# Altium project upper_board.PrjPcb
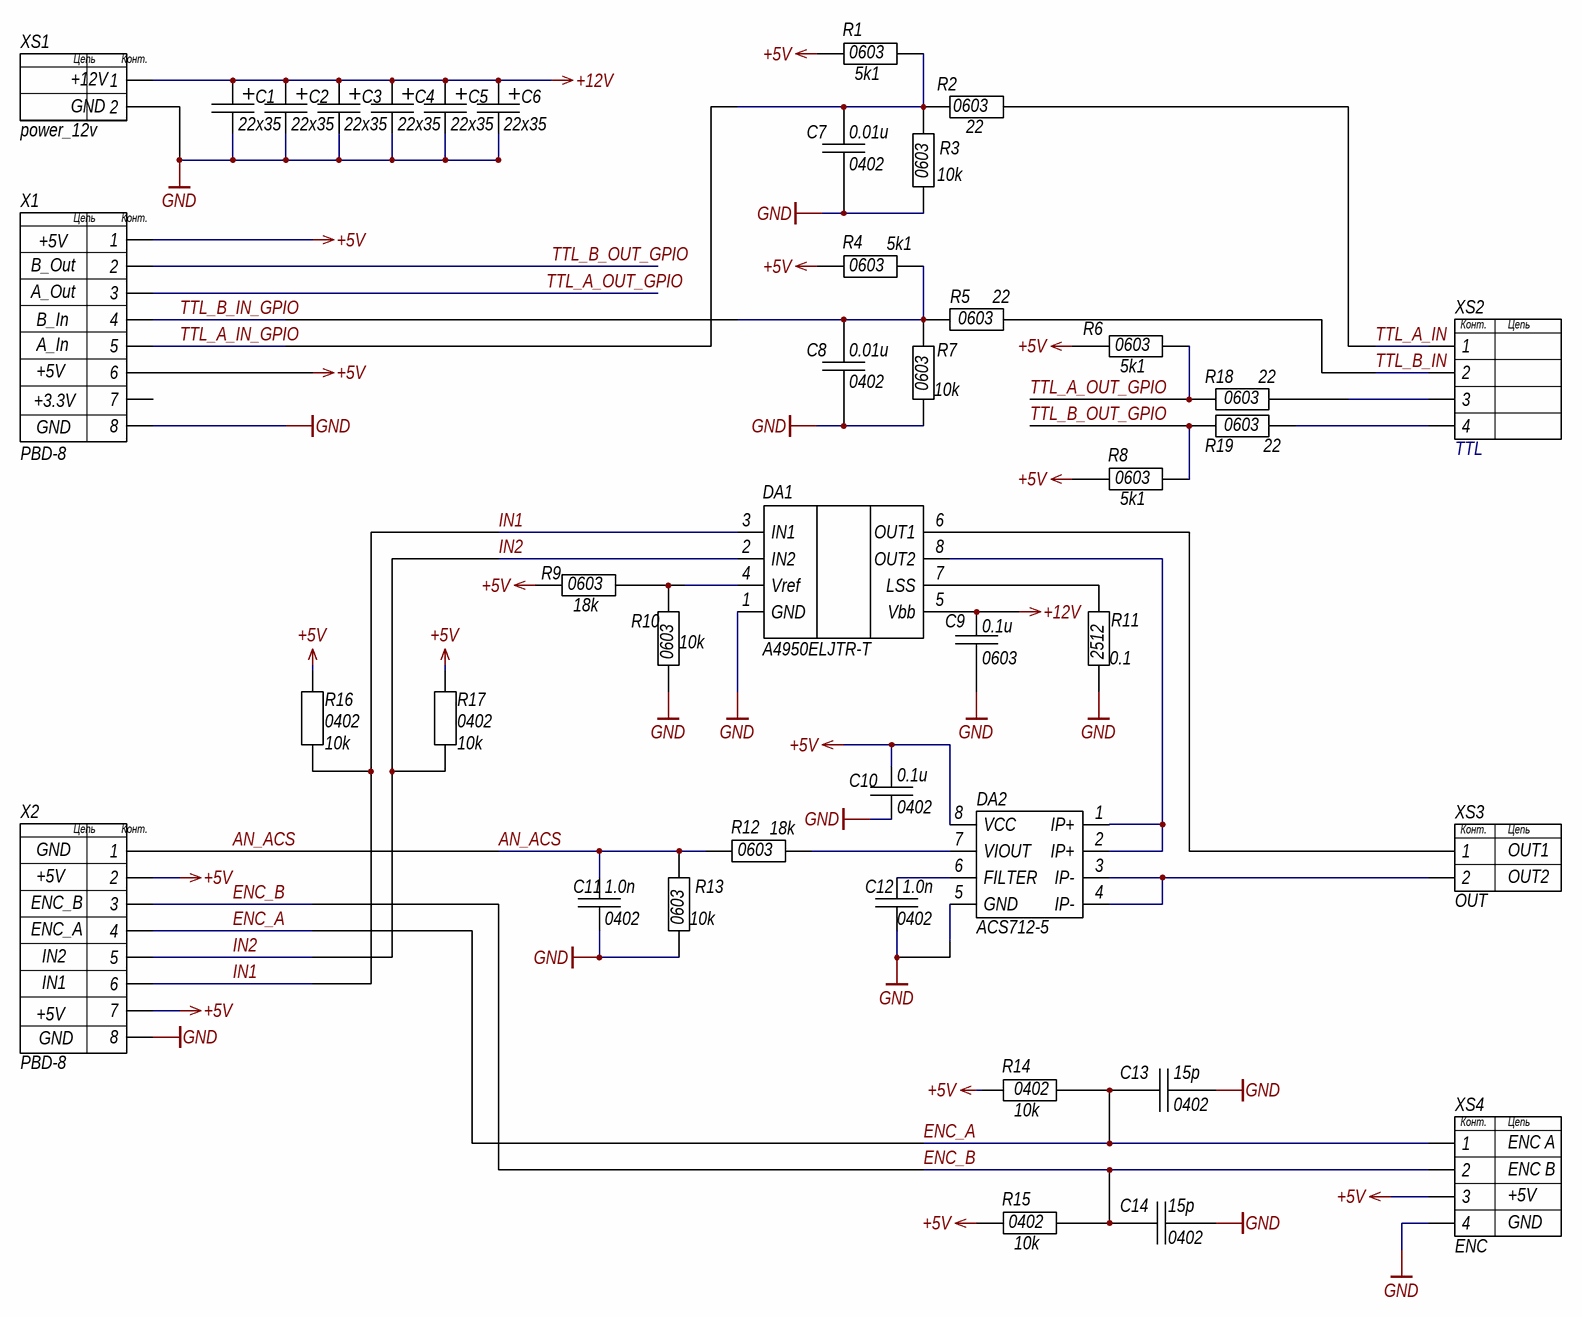
[diagram p0: powerful.SchDoc]
1 sheet, 41 parts. Net scope: global (net labels, ports and power ports of the same name join across sheets).
Board file: upper_PCB.PcbDoc

## Sheet powerful.SchDoc
size 420 x 297 mm; SheetNumber: 1; SheetTotal: 1

### Parts
C1  22x35  [CASE D]
C2  22x35  [CASE D]
C3  22x35  [CASE D]
C4  22x35  [CASE D]
C5  22x35  [CASE D]
C6  22x35  [CASE D]
C7  Case: 0402  [0402_CAP]  (hidden comment: 0.01u)
C8  Case: 0402  [0402_CAP]  (hidden comment: 0.01u)
C9  Case: 0603  [0603_CAP]  (hidden comment: 0.1u)
C10  Case: 0402  [0402_CAP]  (hidden comment: 0.1u)
C11  Case: 0402  [0402_CAP]  (hidden comment: 1.0n)
C12  Case: 0402  [0402_CAP]  (hidden comment: 1.0n)
C13  Case: 0402  [0402_CAP]  (hidden comment: 15p)
C14  Case: 0402  [0402_CAP]  (hidden comment: 15p)
DA1  A4950ELJTR-T  [SOIC-8-ER]
DA2  ACS712-5  [SOIC-8]
R1  Case: 0603  [0603_RES]  (hidden comment: 5k1)
R2  Power: 0603  [0603_RES]  (hidden comment: 22)
R3  Case: 0603  [0603_RES]  (hidden comment: 10k)
R4  Case: 0603  [0603_RES]  (hidden comment: 5k1)
R5  Power: 0603  [0603_RES]  (hidden comment: 22)
R6  Case: 0603  [0603_RES]  (hidden comment: 5k1)
R7  Case: 0603  [0603_RES]  (hidden comment: 10k)
R8  Case: 0603  [0603_RES]  (hidden comment: 5k1)
R9  Case: 0603  [0603_RES]  (hidden comment: 18k)
R10  Case: 0603  [0603_RES]  (hidden comment: 10k)
R11  Case: 2512  [2512_res]  (hidden comment: 0.1)
R12  Case: 0603  [0603_RES]  (hidden comment: 18k)
R13  Case: 0603  [0603_RES]  (hidden comment: 10k)
R14  Case: 0402  [0402_res]  (hidden comment: 10k)
R15  Case: 0402  [0402_res]  (hidden comment: 10k)
R16  Case: 0402  [0402_res]  (hidden comment: 10k)
R17  Case: 0402  [0402_res]  (hidden comment: 10k)
R18  Power: 0603  [0603_RES]  (hidden comment: 22)
R19  Power: 0603  [0603_RES]  (hidden comment: 22)
X1  PBD-8  Parameter 8: GND  Parameter 7: +3.3V  Parameter 6: +5V  Parameter 5: A_In  Parameter 4: B_In  Parameter 3: A_Out  Parameter 2: B_Out  [Header_8pin_2mm]
X2  PBD-8  Parameter 8: GND  Parameter 7: +5V  Parameter 6: IN1  Parameter 5: IN2  Parameter 4: ENC_A  Parameter 3: ENC_B  [Header_8pin_2mm]
XS1  power_12v  [STEP_2.54mm 2X1]
XS2  TTL  [PH4_2mm]
XS3  OUT  [step_2.54_2]
XS4  ENC  [PH4_2mm]

### Nets
+5V: C10.2 DA2.8(VCC) R1.2 R4.2 R6.2 R8.2 R9.2 R14.2 R15.2 R16.2 R17.2 X1.1 X1.6 X2.2 X2.7 XS4.3
+12V: C1.1 C2.1 C3.1 C4.1 C5.1 C6.1 C9.1 DA1.5(Vbb) XS1.1
GND: C1.2 C2.2 C3.2 C4.2 C5.2 C6.2 C7.1 C8.1 C9.2 C10.1 C11.1 C12.1 C13.2 C14.1 DA1.1(GND) DA2.5(GND) R3.1 R7.1 R10.1 R11.2 R13.1 X1.8 X2.8 XS1.2 XS4.4
AN_ACS: C11.2 R12.1 R13.2 X2.1
ENC_A: C13.1 R14.1 X2.4 XS4.1
ENC_B: C14.2 R15.1 X2.3 XS4.2
IN1: DA1.3(IN1) R16.1 X2.6
IN2: DA1.2(IN2) R17.1 X2.5
TTL_A_IN: R2.2 XS2.1
TTL_A_IN_GPIO: C7.2 R1.1 R2.1 R3.2 X1.5
TTL_A_OUT_GPIO: R6.1 R18.1 X1.3
TTL_B_IN: R5.2 XS2.2
TTL_B_IN_GPIO: C8.2 R4.1 R5.1 R7.2 X1.4
TTL_B_OUT_GPIO: R8.1 R19.1 X1.2
NetC12_2: C12.2 DA2.6(FILTER)
NetDA1_4: DA1.4(Vref) R9.1 R10.2
NetDA1_6: DA1.6(OUT1) XS3.1
NetDA1_7: DA1.7(LSS) R11.1
NetDA1_8: DA1.8(OUT2) DA2.1(IP+) DA2.2(IP+)
NetDA2_3: DA2.3(IP-) DA2.4(IP-) XS3.2
NetDA2_7: DA2.7(VIOUT) R12.2
NetR18_2: R18.2 XS2.3
NetR19_2: R19.2 XS2.4

Not connected (* = marked no-connect by the designer): X1 7

### Notes on the sheet
- Подп. и дата
- Инв. № дубл.
- Взам. инв. №
- Инв. № подл.
- Изм.
- Лист
- № докум.
- Подп.
- Дата
- Копировал
- Формат А3
- (in symbol Connecor_8pin) Цепь; Конт.
- (in symbol ENC) Конт.; Цепь; ENC A; ENC B; +5V; GND
- (in symbol OUT) Конт.; Цепь; OUT1; OUT2
- (in symbol power_12v) Цепь; Конт.; +12V; GND
- (in symbol TTL) Конт.; Цепь

### Library data of the parts
C1-C6 = Capacitor_pol: ValueType: Конденсатор; Value: 22x35
C7-C14 = Capacitor: ValueType: Конденсатор; ESR: *; Voltage: *; Dielectric: *; Package: =; Parameter 1: *
  C7 C8: Value: 0.01u
  C9 C10: Value: 0.1u
  C11 C12: Value: 1.0n
  C13 C14: Value: 15p
DA1 = A4950ELJTR-T: ValueManufacturer: Allegro Microsystems; ValueType: ШИМ драйвер двигателей; ValueDescriptioneter 1: Full-Bridge; NomenclatureNumber: 9001130282; ComponentLink1Description: chipdip; ComponentLink1URL: https://www.chipdip.ru/product/a4950eljtr-t
DA2 = CurrentSensor_ACS712-5
R1-R19 = Resistor: ValueType: Резистор; Tolerance: *; URL: *; Temp: *; ValueManufacturer: *; ValueManufacturerPartNumber: *; ValueDescription: *
  R1 R4 R6 R8: Power: *; Value: 5k1
  R2 R5 R18 R19: Case: *; Value: 22
  R3 R7 R10 R13-R17: Power: *; Value: 10k
  R9 R12: Power: *; Value: 18k
  R11: Power: *; Value: 0.1
X1 X2 = Connecor_8pin: System: Connector
  X1: Parameter 1: +5V
  X2: Parameter 2: +5V; Parameter 1: GND